# Altium project Recv.PrjPcb
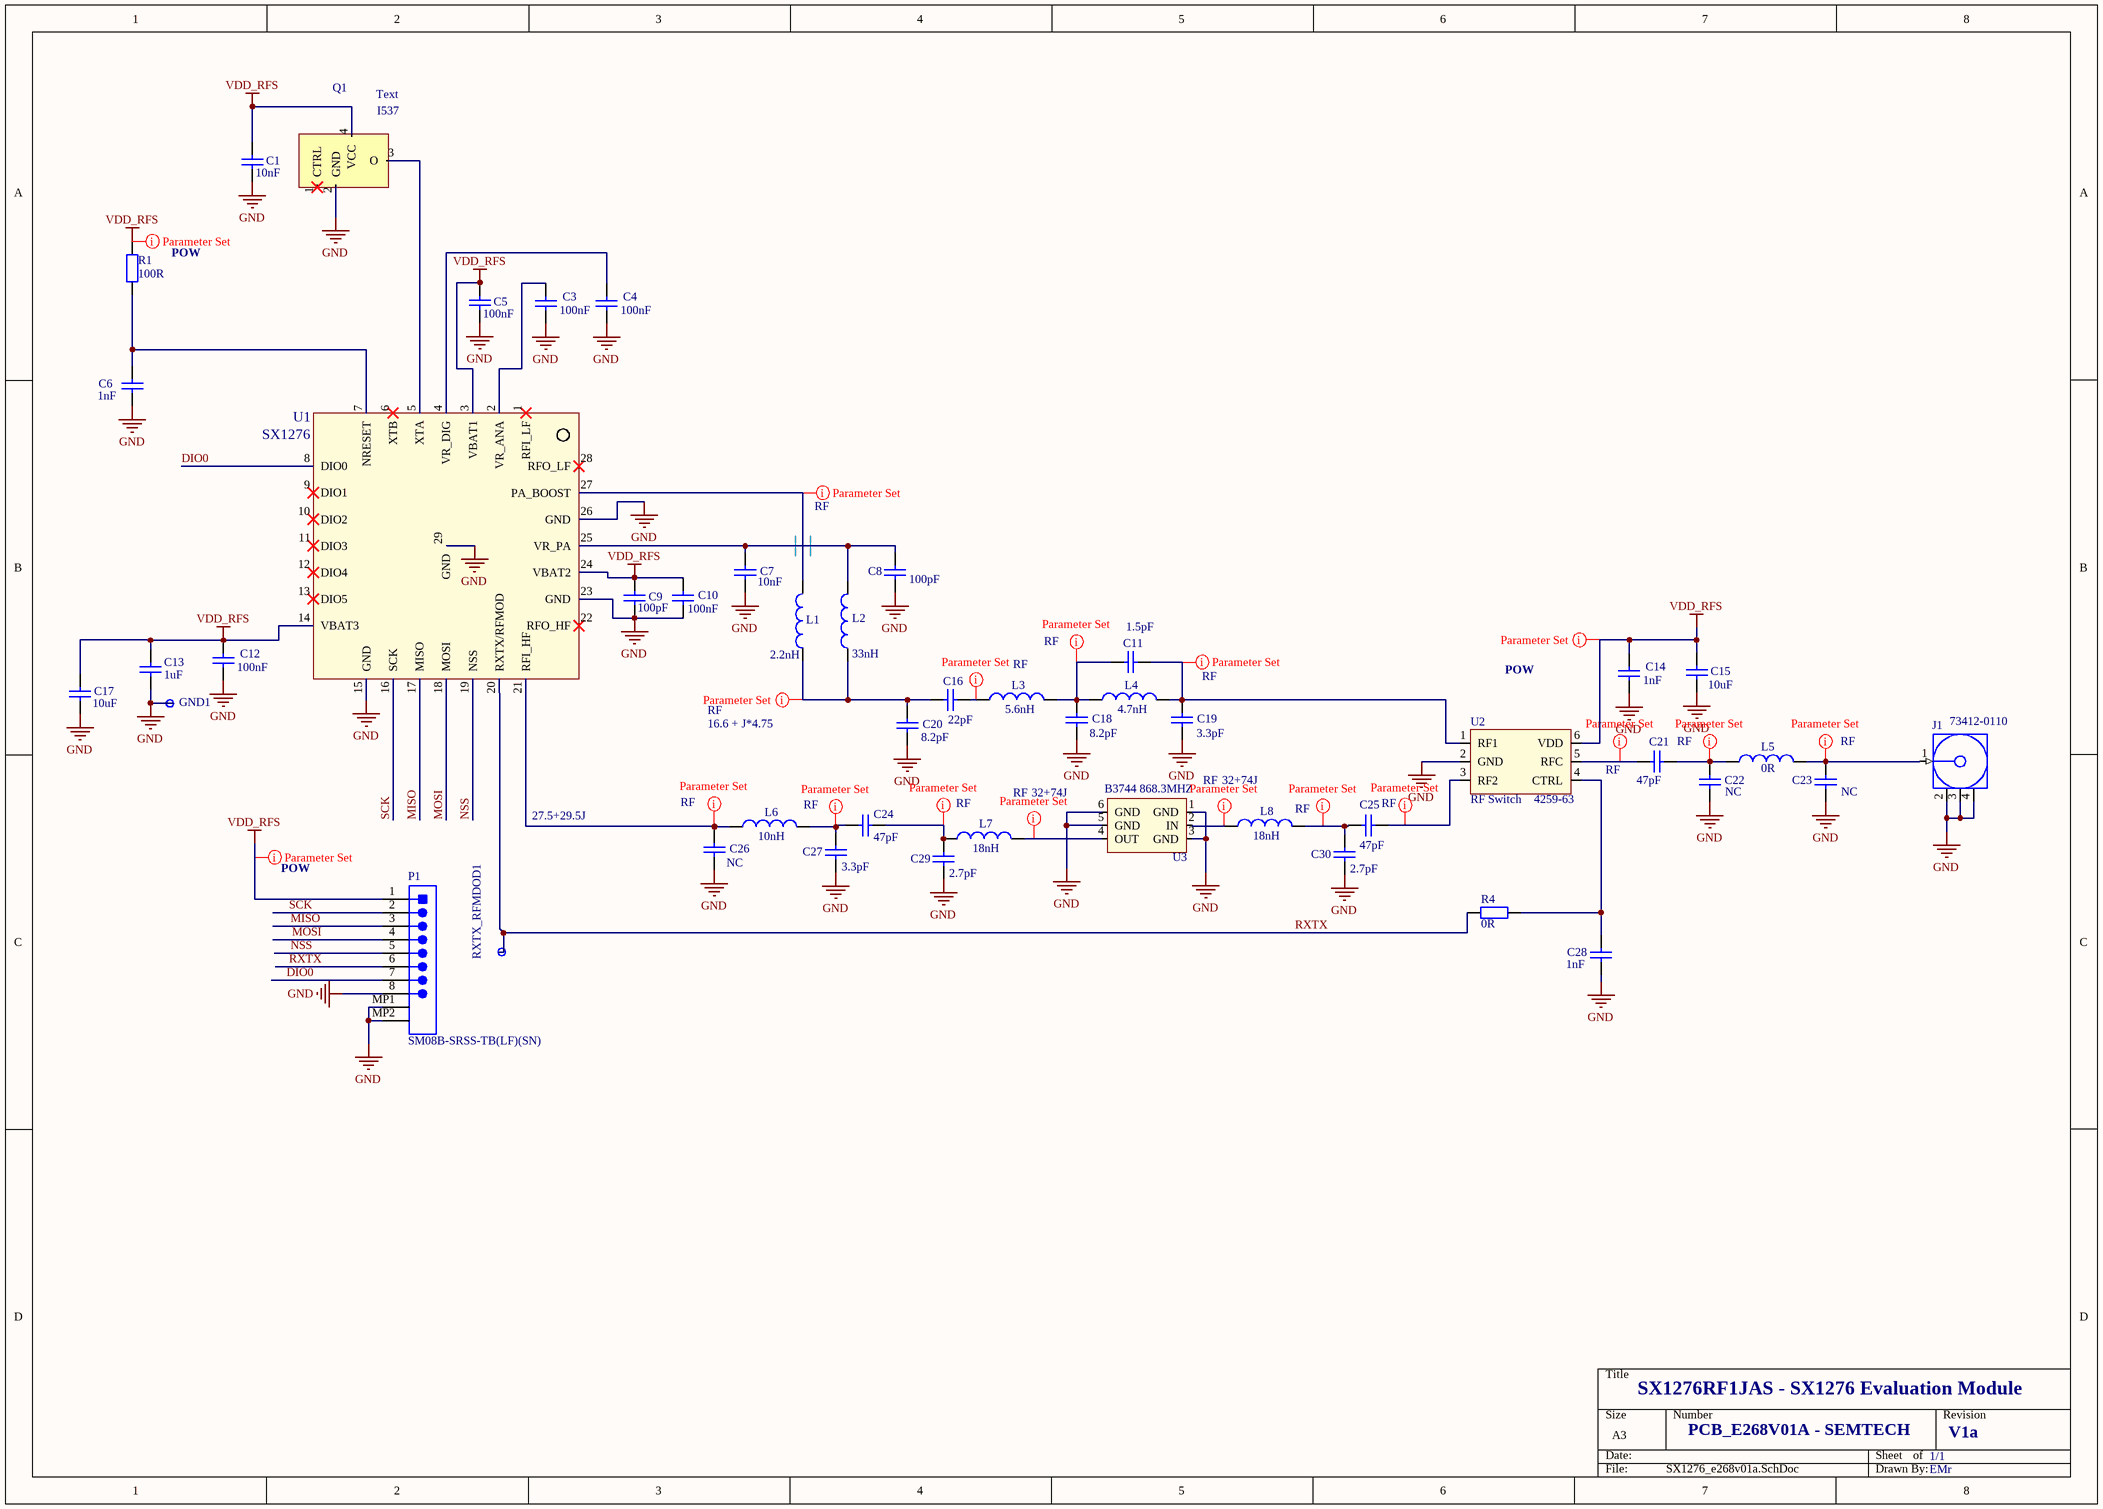
[diagram p0: SX1276_e268v01a.SchDoc]
1 sheet, 47 parts. Net scope: global (net labels, ports and power ports of the same name join across sheets).
Board file: Recv.PcbDoc

## Sheet SX1276_e268v01a.SchDoc
size A3

### Parts
C1  value 10nF  [rlc_402_smd]  (hidden comment: Cap)
C3  value 100nF  [rlc_402_smd]  (hidden comment: Cap)
C4  value 100nF  [rlc_402_smd]  (hidden comment: Cap)
C5  value 100nF  [rlc_402_smd]  (hidden comment: Cap)
C6  value 1nF  [rlc_402_smd]  (hidden comment: Cap)
C7  value 10nF  [rlc_402_smd]  (hidden comment: Cap)
C8  value 100pF  [rlc_402_smd]  (hidden comment: Cap)
C9  value 100pF  [rlc_402_smd]  (hidden comment: Cap)
C10  value 100nF  [rlc_402_smd]  (hidden comment: Cap)
C11  value 1.5pF  [rlc_402_smd]  (hidden comment: Cap)
C12  value 100nF  [rlc_402_smd]  (hidden comment: Cap)
C13  value 1uF  [rlc_603_smd]  (hidden comment: Cap Semi)
C14  value 1nF  [rlc_402_smd]  (hidden comment: Cap)
C15  value 10uF  [rlc_805_smd]  (hidden comment: Cap)
C16  value 22pF  [rlc_402_smd]  (hidden comment: Cap)
C17  value 10uF  [rlc_805_smd]  (hidden comment: Cap)
C18  value 8.2pF  [rlc_402_smd]  (hidden comment: Cap)
C19  value 3.3pF  [rlc_402_smd]  (hidden comment: Cap)
C20  value 8.2pF  [rlc_402_smd]  (hidden comment: Cap)
C21  value 47pF  [rlc_402_smd]  (hidden comment: Cap)
C22  value NC  [rlc_402_smd]  (hidden comment: Cap)
C23  value NC  [rlc_402_smd]  (hidden comment: Cap)
C24  value 47pF  [rlc_402_smd]  (hidden comment: Cap)
C25  value 47pF  [rlc_402_smd]  (hidden comment: Cap)
C26  NC  [rlc_402_smd]
C27  value 3.3pF  [rlc_402_smd]  (hidden comment: Cap)
C28  value 1nF  [rlc_402_smd]  (hidden comment: Cap)
C29  value 2.7pF  [rlc_402_smd]  (hidden comment: Cap)
C30  value 2.7pF  [rlc_402_smd]  (hidden comment: Cap)
GND1  Test Pin  [pin_1mm]  (value not drawn)
J1  73412-0110  [MOLX-73412-0110_V]
L1  value 2.2nH  [rlc_402_smd]  (hidden comment: Inductor)
L2  value 33nH  [rlc_402_smd]  (hidden comment: Inductor)
L3  value 5.6nH  [rlc_402_smd]  (hidden comment: Inductor)
L4  value 4.7nH  [rlc_402_smd]  (hidden comment: Inductor)
L5  value 0R  [rlc_402_smd]  (hidden comment: Inductor)
L6  value 10nH  [rlc_402_smd]  (hidden comment: Inductor)
L7  value 18nH  [rlc_402_smd]  (hidden comment: Inductor)
L8  value 18nH  [rlc_402_smd]  (hidden comment: Inductor)
P1  SM08B-SRSS-TB(LF)(SN)  [JST-SM08B-SRSS-TB_V]
Q1  I537  [nd3225da]
R1  value 100R  [rlc_402_smd]  (hidden comment: Resistor)
R4  value 0R  [rlc_402_smd]  (hidden comment: Resistor)
RXTX_RFMDOD1  Test Pin  [pin_SMD]  (value not drawn)
U1  SX1276  [vqfn28_6x6mm]
U2  RF Switch  value 4259-63  [SC70-6]
U3  B3744 868.3MHZ  [DCC6C_3.0x3.0mm]

### Nets
GND: C1.1 C3.1 C4.1 C5.1 C6.2 C7.1 C8.1 C9.1 C10.1 C12.1 C13.1 C14.1 C15.1 C17.1 C18.1 C19.1 C20.1 C22.1 C23.1 C26.1 C27.1 C28.2 C29.1 C30.1 GND1.1(pin) J1.2(GND) J1.3(GND) J1.4(GND) P1.8 P1.MP1 P1.MP2 Q1.2(GND) U1.15(GND) U1.23(GND) U1.26(GND) U1.29(GND) U2.2(GND) U3.1(GND) U3.3(GND) U3.5(GND) U3.6(GND)
VDD_RFS: C1.2 C5.2 C9.2 C10.2 C12.2 C13.2 C14.2 C15.2 C17.2 P1.1 Q1.4(VCC) R1.2 U1.3(VBAT1) U1.14(VBAT3) U1.24(VBAT2) U2.6(VDD)
DIO0: P1.7 U1.8(DIO0)
MISO: P1.3 U1.17(MISO)
MOSI: P1.4 U1.18(MOSI)
NSS: P1.5 U1.19(NSS)
RXTX: P1.6 R4.1 RXTX_RFMDOD1.1(pin) U1.20(RXTX/RFMOD)
SCK: P1.2 U1.16(SCK)
NetC3_2: C3.2 U1.2(VR_ANA)
NetC4_2: C4.2 U1.4(VR_DIG)
NetC6_1: C6.1 R1.1 U1.7(NRESET)
NetC7_2: C7.2 C8.2 L2.2 U1.25(VR_PA)
NetC11_1: C11.1 C19.2 L4.2 U2.1(RF1)
NetC11_2: C11.2 C18.2 L3.2 L4.1
NetC16_1: C16.1 L3.1
NetC16_2: C16.2 C20.2 L1.1 L2.1
NetC21_1: C21.1 C22.2 L5.1
NetC21_2: C21.2 U2.5(RFC)
NetC23_2: C23.2 J1.1(SIGNAL) L5.2
NetC24_1: C24.1 C29.2 L7.1
NetC24_2: C24.2 C27.2 L6.2
NetC25_1: C25.1 U2.3(RF2)
NetC25_2: C25.2 C30.2 L8.2
NetC26_2: C26.2 L6.1 U1.21(RFI_HF)
NetC28_1: C28.1 R4.2 U2.4(CTRL)
NetL1_2: L1.2 U1.27(PA_BOOST)
NetL7_2: L7.2 U3.4(OUT)
NetL8_1: L8.1 U3.2(IN)
NetQ1_3: Q1.3(O) U1.5(XTA)

Not connected (* = marked no-connect by the designer): Q1 1(CTRL)*; U1 1(RFI_LF)* 6(XTB)* 9(DIO1)* 10(DIO2)* 11(DIO3)* 12(DIO4)* 13(DIO5)* 22(RFO_HF)* 28(RFO_LF)*

### Layout directives
net class RF: NetC11_1, NetC11_2, NetC16_1, NetC21_1, NetC21_2, NetC23_2, NetC24_1, NetC24_2, NetC25_1, NetC25_2, NetL1_2
net class RF; Z: 16.6 + J*4.75: NetC16_2
net class RF; Z: 27.5+29.5J: NetC26_2
net class POW: VDD_RFS
net class RF; Z: 32+74J: NetL7_2, NetL8_1

### Notes on the sheet
- SX1276RF1JAS - SX1276 Evaluation Module
- PCB_E268V01A - SEMTECH
- 1/1
- V1a
- EMr
- (in symbol TCXO) Text

### Library data of the parts
C1 C3-C12 C14-C30 = Cap: Capacitor SMD; Published: 8-Jun-2000; LatestRevisionDate: 05-oct-2007  -  Semtech; LatestRevisionNote: Re-released for DXP Platform.; Publisher: Altium Limited
  C26: Value: NC
C13 = Cap Semi: Capacitor (Semiconductor SIM Model); Published: 8-Jun-2000; LatestRevisionDate: 05-oct-2007  -  Semtech; LatestRevisionNote: Re-released for DXP Platform.; Publisher: Altium Limited
GND1 RXTX_RFMDOD1 = test_pin: LatestRevisionDate: 05-oct-2007  -  Semtech
J1 = CMP-1676-00003-1: MCRF, PCB Vertical Jack Receptacle, 50 Ohm, 4-Pin SMD, RoHS, Tape and Reel; Voltage Rating (AC): 60 V; Mating Cycles: 30; Impedance: 50 Ohm; Frequency: 6 Hz; Gender: Female; RoHSCompliant: true; Length: 3 mm; DatasheetVersion: 04/2016; ComponentLink3URL: http://www.molex.com/pdm_docs/sd/734120110_sd.pdf; Max Operating Temperature: 90 degC; Contact Material: Bronze; Mount: Surface Mount; ComponentLink2Description: Datasheet; Packaging: Tape and Reel; Radiation Hardening: No; Voltage Rating: 60 V; Mounting Technology: Surface Mount; ComponentLink1Description: Manufacturer URL; ComponentLink1URL: http://www.molex.com/; Width: 3 mm; ComponentLink3Description: Package Specification; Package Quantity: 5000; PackageReference: 73412-0110; Min Operating Temperature: -40 degC; Height: 1.25 mm; REACH SVHC: Unknown; ComponentLink2URL: http://www.molex.com/webdocs/datasheets/pdf/en-us/0734120110_RF_COAX_CONNECTORS.pdf; Contact Plating: Gold; PackageDescription: 4-Leads SMD, Body 2.6 x 2.6 mm; PackageVersion: Rev. C14, 07/2015
L1-L8 = Inductor: Inductor SMD; Code_IEC: 1005; Published: 8-Jun-2000; LatestRevisionDate: 05-oct-2007  -  Semtech; LatestRevisionNote: Re-released for DXP Platform.; Publisher: Altium Limited; Code_JEITA: 0402
P1 = CMP-2000-07082-1: Male Header, Pitch 1 mm, 1 x 8 Position, Height 2.95 mm, -25 to 85 degC, RoHS, Tape and Reel; Manufacturer: JST; Style/Orientation: RightAngleHeader/Plug; Pitch: 1mm; No of Positions: 8; Manufacturer URL: http://www.jst.com/home2.html; Mounting Technology: SurfaceMount; Package Description: Male Header, Pitch 1 mm, 1 x 8 Position, Height 2.95 mm; Datasheet URL: http://www.jst-mfg.com/product/pdf/eng/eSR.pdf; Type: ShroudedHeader; Termination: Crimp; Package Reference: SM08B-SRSS-TB; Datasheet Version: 11/2010
Q1 = TCXO: Termally Compensated External Oscillator
R1 R4 = Resistor: Resistor SMD - IEC symbol version; LatestRevisionDate: 27-Jul-20  -  Semtech
U1 = SX1276: SX1276 - Low Power Integrated UHF Transceiver with loRa Modem; LatestRevisionDate: 27-Jul-2009 -  Semtech
U2 = PE4259 RF Switch: PE4259 Peregrine RF Switch; LatestRevisionDate: 03-Sep-2012 -  Semtech
U3 = SAW Filter: SAW Filter - Bandpass - TEMEX type; LatestRevisionDate: 05-oct-2007  -  Semtech